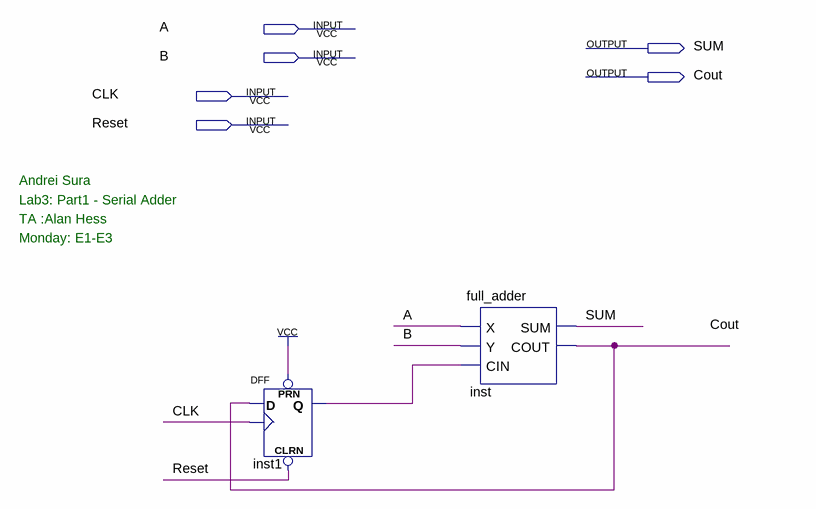
[diagram p0: schematic sheet]
// Quartus schematic lab_5_serial_adder.bdf as structural Verilog: 2 symbols, 6 pins
module lab_5_serial_adder (
  input  A,
  input  B,
  input  CLK,
  input  Reset,
  output SUM,
  output Cout
);

  wire inst1_q;

  DFF inst1 (.CLRN(Reset), .CLK(CLK), .D(Cout), .PRN(1'b1), .Q(inst1_q));
  full_adder inst (.X(A), .Y(B), .CIN(inst1_q), .SUM(SUM), .COUT(Cout));

  // Notes on the sheet:
  //   Andrei Sura
  //   Lab3: Part1 - Serial Adder
  //   TA :Alan Hess
  //   Monday: E1-E3
endmodule
